# EAGLE schematic nixie_clock (EAGLE 9.5.1)
COMPANY: Gimbas; CREVISION: 0.1; DESIGNER: Rafael Silva; LICENSE: MIT; LINK: https://github.com/gimbas/nixie_clock

## Sheet 1 of 4: Nixie board
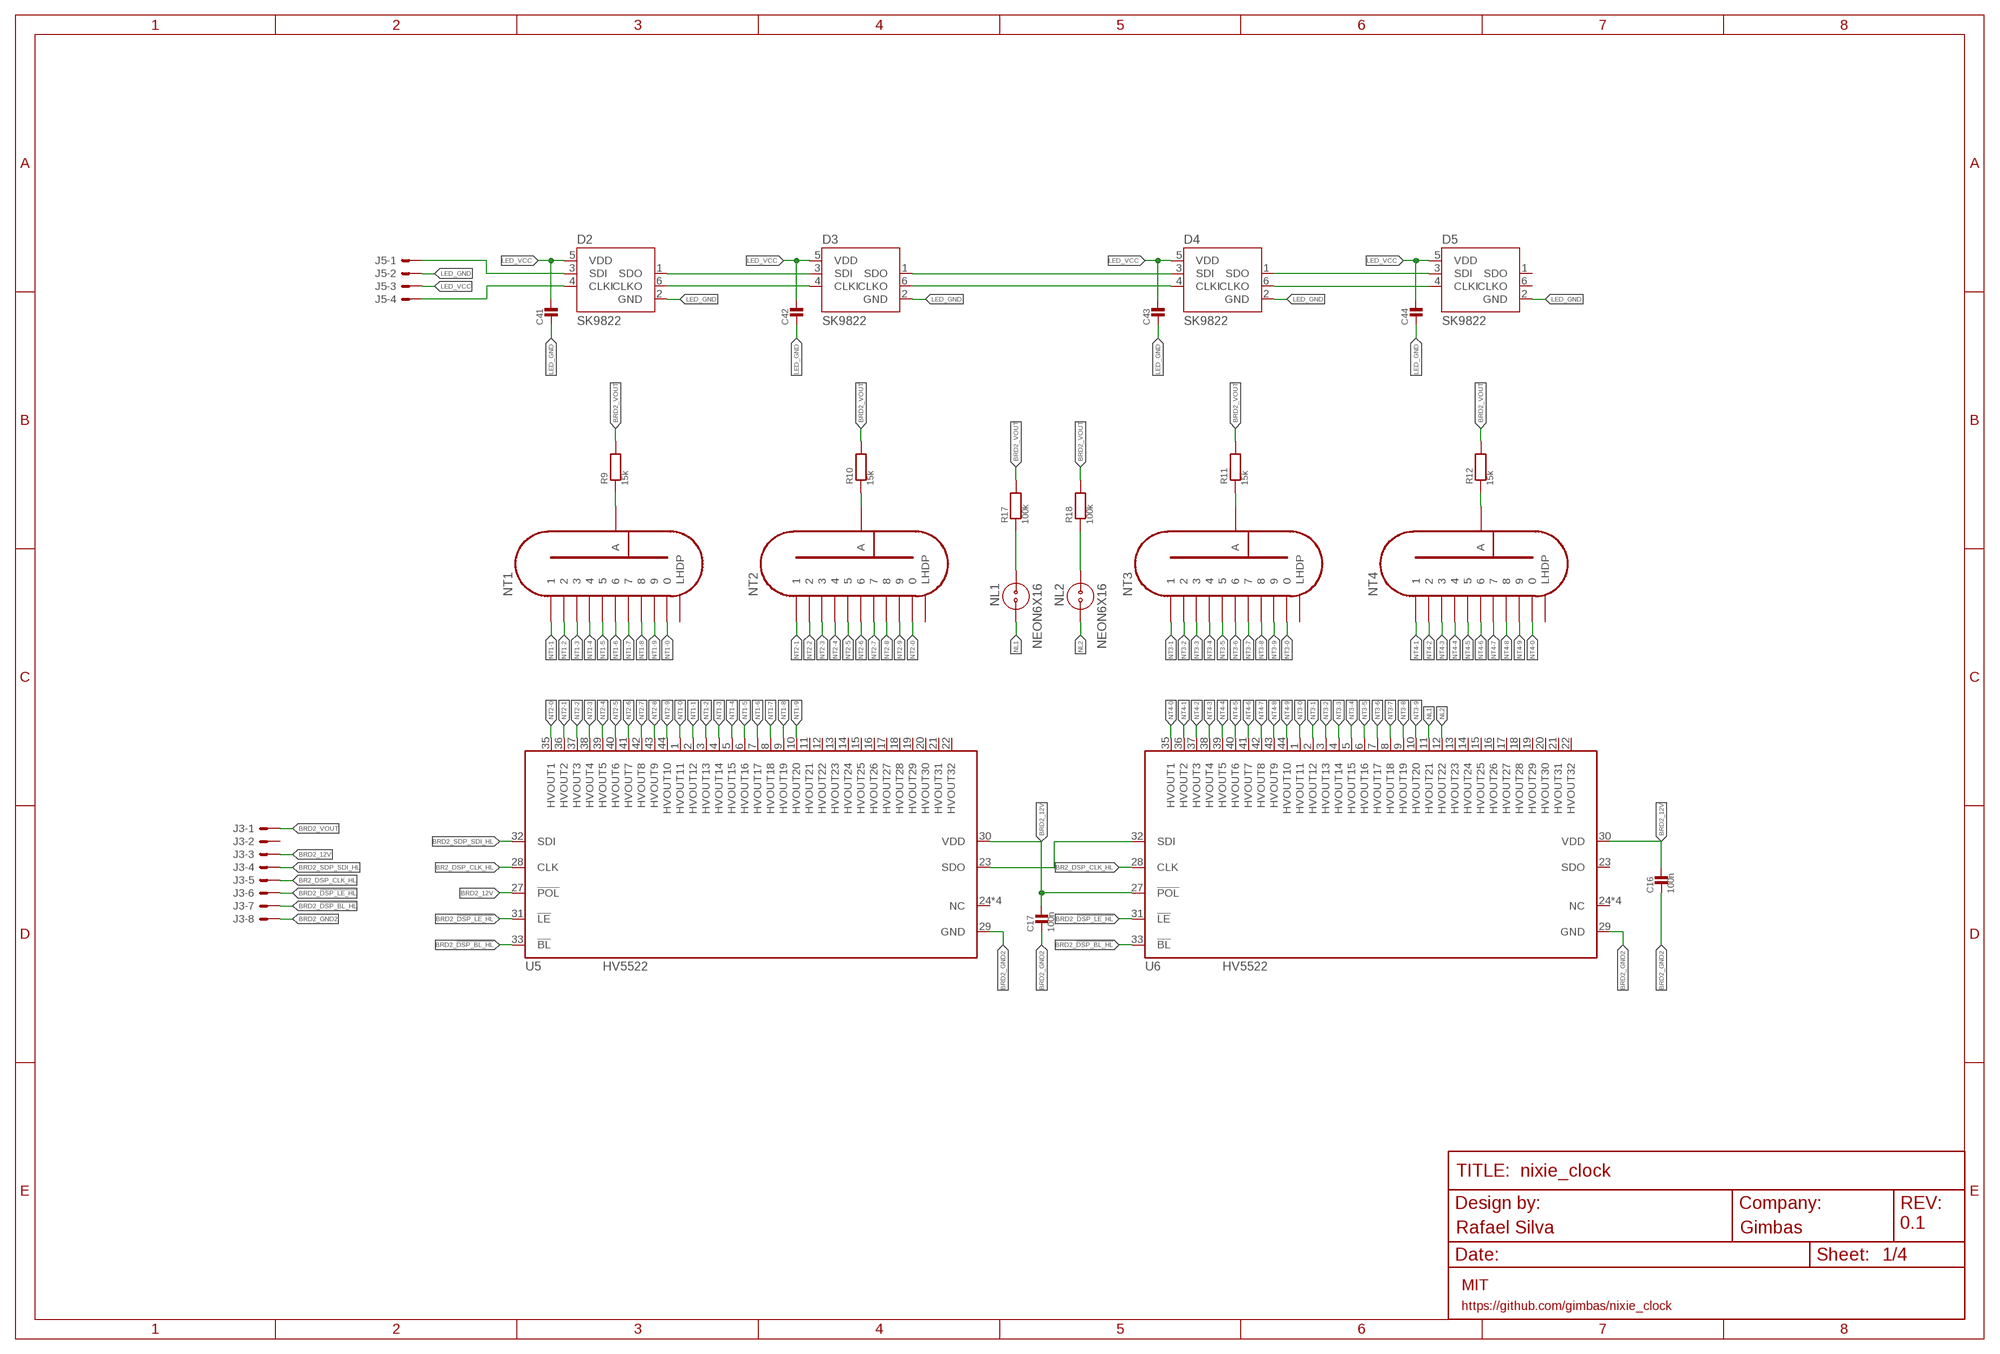
[diagram p0: schematic, sheet 1]

### Parts
C16  100n  MLCC0603  [0603_WAVE]
C17  100n  MLCC0603  [0603_WAVE]
C41  MLCC0603  [0603_WAVE]
C42  MLCC0603  [0603_WAVE]
C43  MLCC0603  [0603_WAVE]
C44  MLCC0603  [0603_WAVE]
D2  SK9822  [2020]
D3  SK9822  [2020]
D4  SK9822  [2020]
D5  SK9822  [2020]
J3  8  [1X8_2.54]
J5  4  [1X4_2.54]
NL1  NEON6X16  [NL-6X16]
NL2  NEON6X16  [NL-6X16]
NT1  IN-12B  [IN-12]
NT2  IN-12B  [IN-12]
NT3  IN-12B  [IN-12]
NT4  IN-12B  [IN-12]
R9  15k  RESISTOR_1206  [_1206]
R10  15k  RESISTOR_1206  [_1206]
R11  15k  RESISTOR_1206  [_1206]
R12  15k  RESISTOR_1206  [_1206]
R17  100k  RESISTOR_1206  [_1206]
R18  100k  RESISTOR_1206  [_1206]
U5  HV5522  [QFP64]
U6  HV5522  [QFP64]

### Nets
BR2_DSP_CLK_HL: J3.5 U5.28(CLK) U6.28(CLK)
BRD2_12V: C16.P$1 C17.P$1 J3.3 U5.27(!POL) U5.30(VDD) U6.27(!POL) U6.30(VDD)
BRD2_!DSP_BL_HL: J3.7 U5.33(!BL) U6.33(!BL)
BRD2_!DSP_LE_HL: J3.6 U5.31(!LE) U6.31(!LE)
BRD2_GND2: C16.P$2 C17.P$2 J3.8 U5.29(GND) U6.29(GND)
BRD2_SDP_SDI_HL: J3.4 U5.32(SDI)
BRD2_VOUT: J3.1 R9.2 R10.2 R11.2 R12.2 R17.2 R18.2
LED_GND: C41.P$2 C42.P$2 C43.P$2 C44.P$2 D2.2(GND) D3.2(GND) D4.2(GND) D5.2(GND) J5.2
LED_VCC: C41.P$1 C42.P$1 C43.P$1 C44.P$1 D2.5(VDD) D3.5(VDD) D4.5(VDD) D5.5(VDD) J5.3
N$1: NT1.A R9.1
N$2: NT2.A R10.1
N$14: NT3.A R11.1
N$15: NT4.A R12.1
N$19: NL1.1 R17.1
N$20: NL2.1 R18.1
N$23: U5.23(SDO) U6.32(SDI)
N$26: D2.3(SDI) J5.1
N$27: D2.4(CLKI) J5.4
N$72: D3.1(SDO) D4.3(SDI)
N$73: D3.6(CLKO) D4.4(CLKI)
N$76: D4.6(CLKO) D5.4(CLKI)
N$77: D4.1(SDO) D5.3(SDI)
N$81: D2.6(CLKO) D3.4(CLKI)
N$82: D2.1(SDO) D3.3(SDI)
NL1: NL1.2 U6.11(HVOUT21)
NL2: NL2.2 U6.12(HVOUT22)
NT1-0: NT1.0 U5.1(HVOUT11)
NT1-1: NT1.1 U5.2(HVOUT12)
NT1-2: NT1.2 U5.3(HVOUT13)
NT1-3: NT1.3 U5.4(HVOUT14)
NT1-4: NT1.4 U5.5(HVOUT15)
NT1-5: NT1.5 U5.6(HVOUT16)
NT1-6: NT1.6 U5.7(HVOUT17)
NT1-7: NT1.7 U5.8(HVOUT18)
NT1-8: NT1.8 U5.9(HVOUT19)
NT1-9: NT1.9 U5.10(HVOUT20)
NT2-0: NT2.0 U5.35(HVOUT1)
NT2-1: NT2.1 U5.36(HVOUT2)
NT2-2: NT2.2 U5.37(HVOUT3)
NT2-3: NT2.3 U5.38(HVOUT4)
NT2-4: NT2.4 U5.39(HVOUT5)
NT2-5: NT2.5 U5.40(HVOUT6)
NT2-6: NT2.6 U5.41(HVOUT7)
NT2-7: NT2.7 U5.42(HVOUT8)
NT2-8: NT2.8 U5.43(HVOUT9)
NT2-9: NT2.9 U5.44(HVOUT10)
NT3-0: NT3.0 U6.1(HVOUT11)
NT3-1: NT3.1 U6.2(HVOUT12)
NT3-2: NT3.2 U6.3(HVOUT13)
NT3-3: NT3.3 U6.4(HVOUT14)
NT3-4: NT3.4 U6.5(HVOUT15)
NT3-5: NT3.5 U6.6(HVOUT16)
NT3-6: NT3.6 U6.7(HVOUT17)
NT3-7: NT3.7 U6.8(HVOUT18)
NT3-8: NT3.8 U6.9(HVOUT19)
NT3-9: NT3.9 U6.10(HVOUT20)
NT4-0: NT4.0 U6.35(HVOUT1)
NT4-1: NT4.1 U6.36(HVOUT2)
NT4-2: NT4.2 U6.37(HVOUT3)
NT4-3: NT4.3 U6.38(HVOUT4)
NT4-4: NT4.4 U6.39(HVOUT5)
NT4-5: NT4.5 U6.40(HVOUT6)
NT4-6: NT4.6 U6.41(HVOUT7)
NT4-7: NT4.7 U6.42(HVOUT8)
NT4-8: NT4.8 U6.43(HVOUT9)
NT4-9: NT4.9 U6.44(HVOUT10)
Unconnected: D5.1(SDO) D5.6(CLKO) J3.2 NT1.LHDP NT2.LHDP NT3.LHDP NT4.LHDP U5.11(HVOUT21) U5.12(HVOUT22) U5.13(HVOUT23) U5.14(HVOUT24) U5.15(HVOUT25) U5.16(HVOUT26) U5.17(HVOUT27) U5.18(HVOUT28) U5.19(HVOUT29) U5.20(HVOUT30) U5.21(HVOUT31) U5.22(HVOUT32) U5.24(NC) U5.25(NC) U5.26(NC) U5.34(NC) U6.13(HVOUT23) U6.14(HVOUT24) U6.15(HVOUT25) U6.16(HVOUT26) U6.17(HVOUT27) U6.18(HVOUT28) U6.19(HVOUT29) U6.20(HVOUT30) U6.21(HVOUT31) U6.22(HVOUT32) U6.23(SDO) U6.24(NC) U6.25(NC) U6.26(NC) U6.34(NC)

## Sheet 2 of 4: other
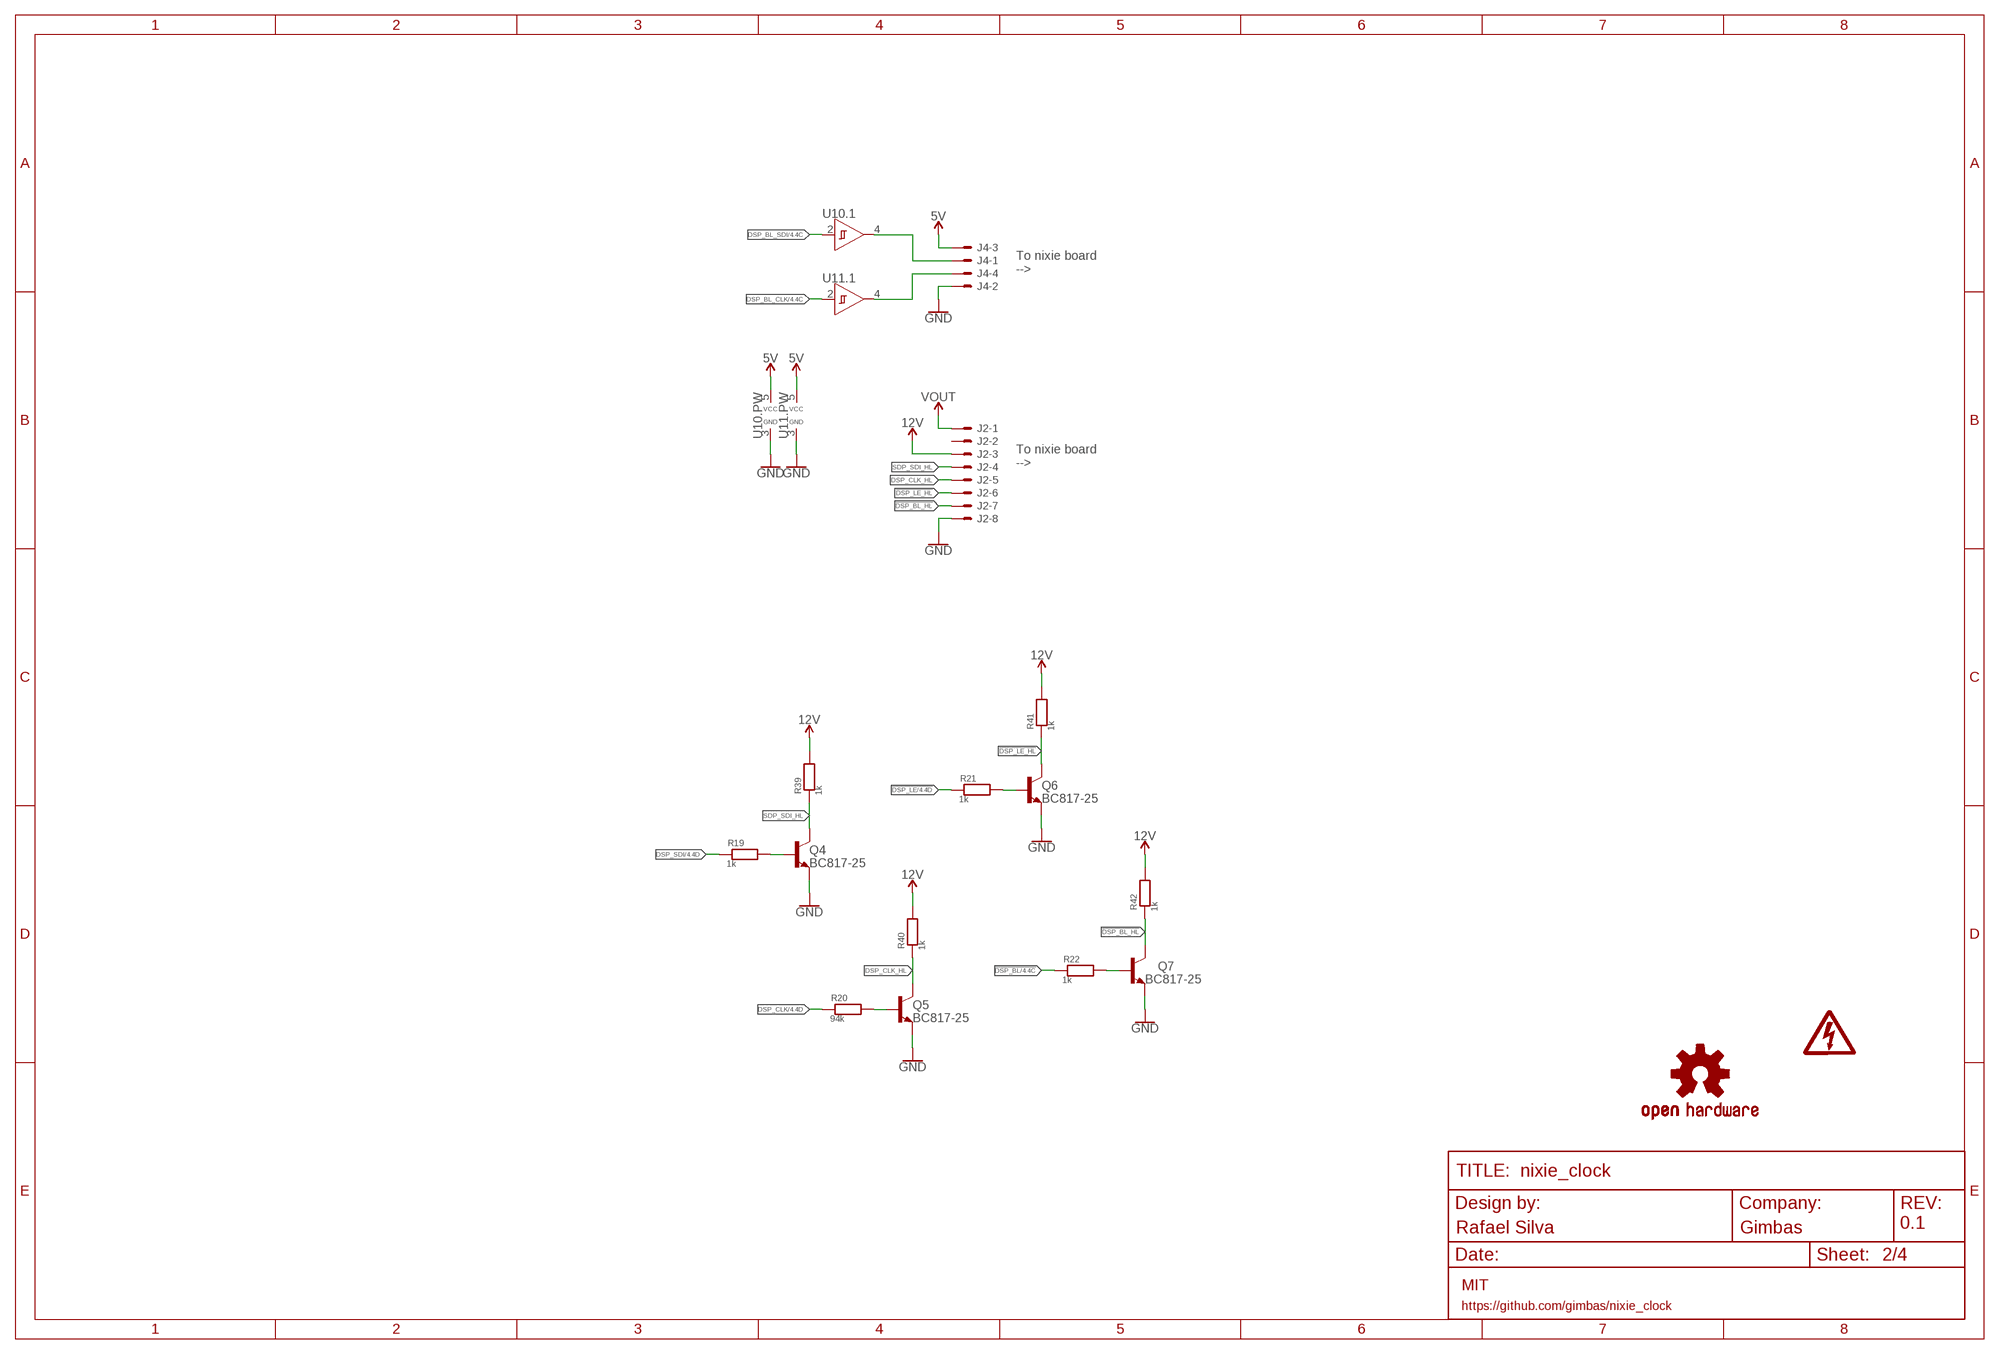
[diagram p1: schematic, sheet 2]

### Parts
J2  8  [1X8_2.54]
J4  4  [1X4_2.54]
LOGO3  OSHW-LOGOL  [OSHW-LOGO-L]
LOGO6  HV_WARNING  [HV_WARNING]
Q4  BC817-25  [SOT-23-3]
Q5  BC817-25  [SOT-23-3]
Q6  BC817-25  [SOT-23-3]
Q7  BC817-25  [SOT-23-3]
R19  1k  RESISTOR0603  [0603_WAVE]
R20  94k  RESISTOR0603  [0603_WAVE]
R21  1k  RESISTOR0603  [0603_WAVE]
R22  1k  RESISTOR0603  [0603_WAVE]
R39  1k  RESISTOR0603  [0603_WAVE]
R40  1k  RESISTOR0603  [0603_WAVE]
R41  1k  RESISTOR0603  [0603_WAVE]
R42  1k  RESISTOR0603  [0603_WAVE]
U10  74LVC1G17  [SC70-5]
U11  74LVC1G17  [SC70-5]

### Nets
5V: J4.3 U10.5(.PW:VCC) U11.5(.PW:VCC) ; also sheet 3,4
12V: J2.3 R39.P$2 R40.P$2 R41.P$2 R42.P$2 ; also sheet 3
!DSP_BL: R22.P$1 ; also sheet 4
!DSP_BL_HL: J2.7 Q7.P$3(C03) R42.P$1
!DSP_LE: R21.P$1 ; also sheet 4
!DSP_LE_HL: J2.6 Q6.P$3(C03) R41.P$1
DSP_BL_CLK: U11.2(.1:A) ; also sheet 4
DSP_BL_SDI: U10.2(.1:A) ; also sheet 4
DSP_CLK: R20.P$1 ; also sheet 4
DSP_CLK_HL: J2.5 Q5.P$3(C03) R40.P$1
DSP_SDI: R19.P$1 ; also sheet 4
GND: J2.8 J4.2 Q4.P$2(EM2) Q5.P$2(EM2) Q6.P$2(EM2) Q7.P$2(EM2) U10.3(.PW:GND) U11.3(.PW:GND) ; also sheet 3,4
N$21: Q4.P$1(BA1) R19.P$2
N$22: Q5.P$1(BA1) R20.P$2
N$24: Q7.P$1(BA1) R22.P$2
N$25: Q6.P$1(BA1) R21.P$2
N$29: J4.4 U11.4(.1:Y)
N$30: J4.1 U10.4(.1:Y)
SDP_SDI_HL: J2.4 Q4.P$3(C03) R39.P$1
VOUT: J2.1 ; also sheet 3
Unconnected: J2.2

### Notes on the sheet
- To nixie board
  -->
- To nixie board
  -->

## Sheet 3 of 4: Supplys
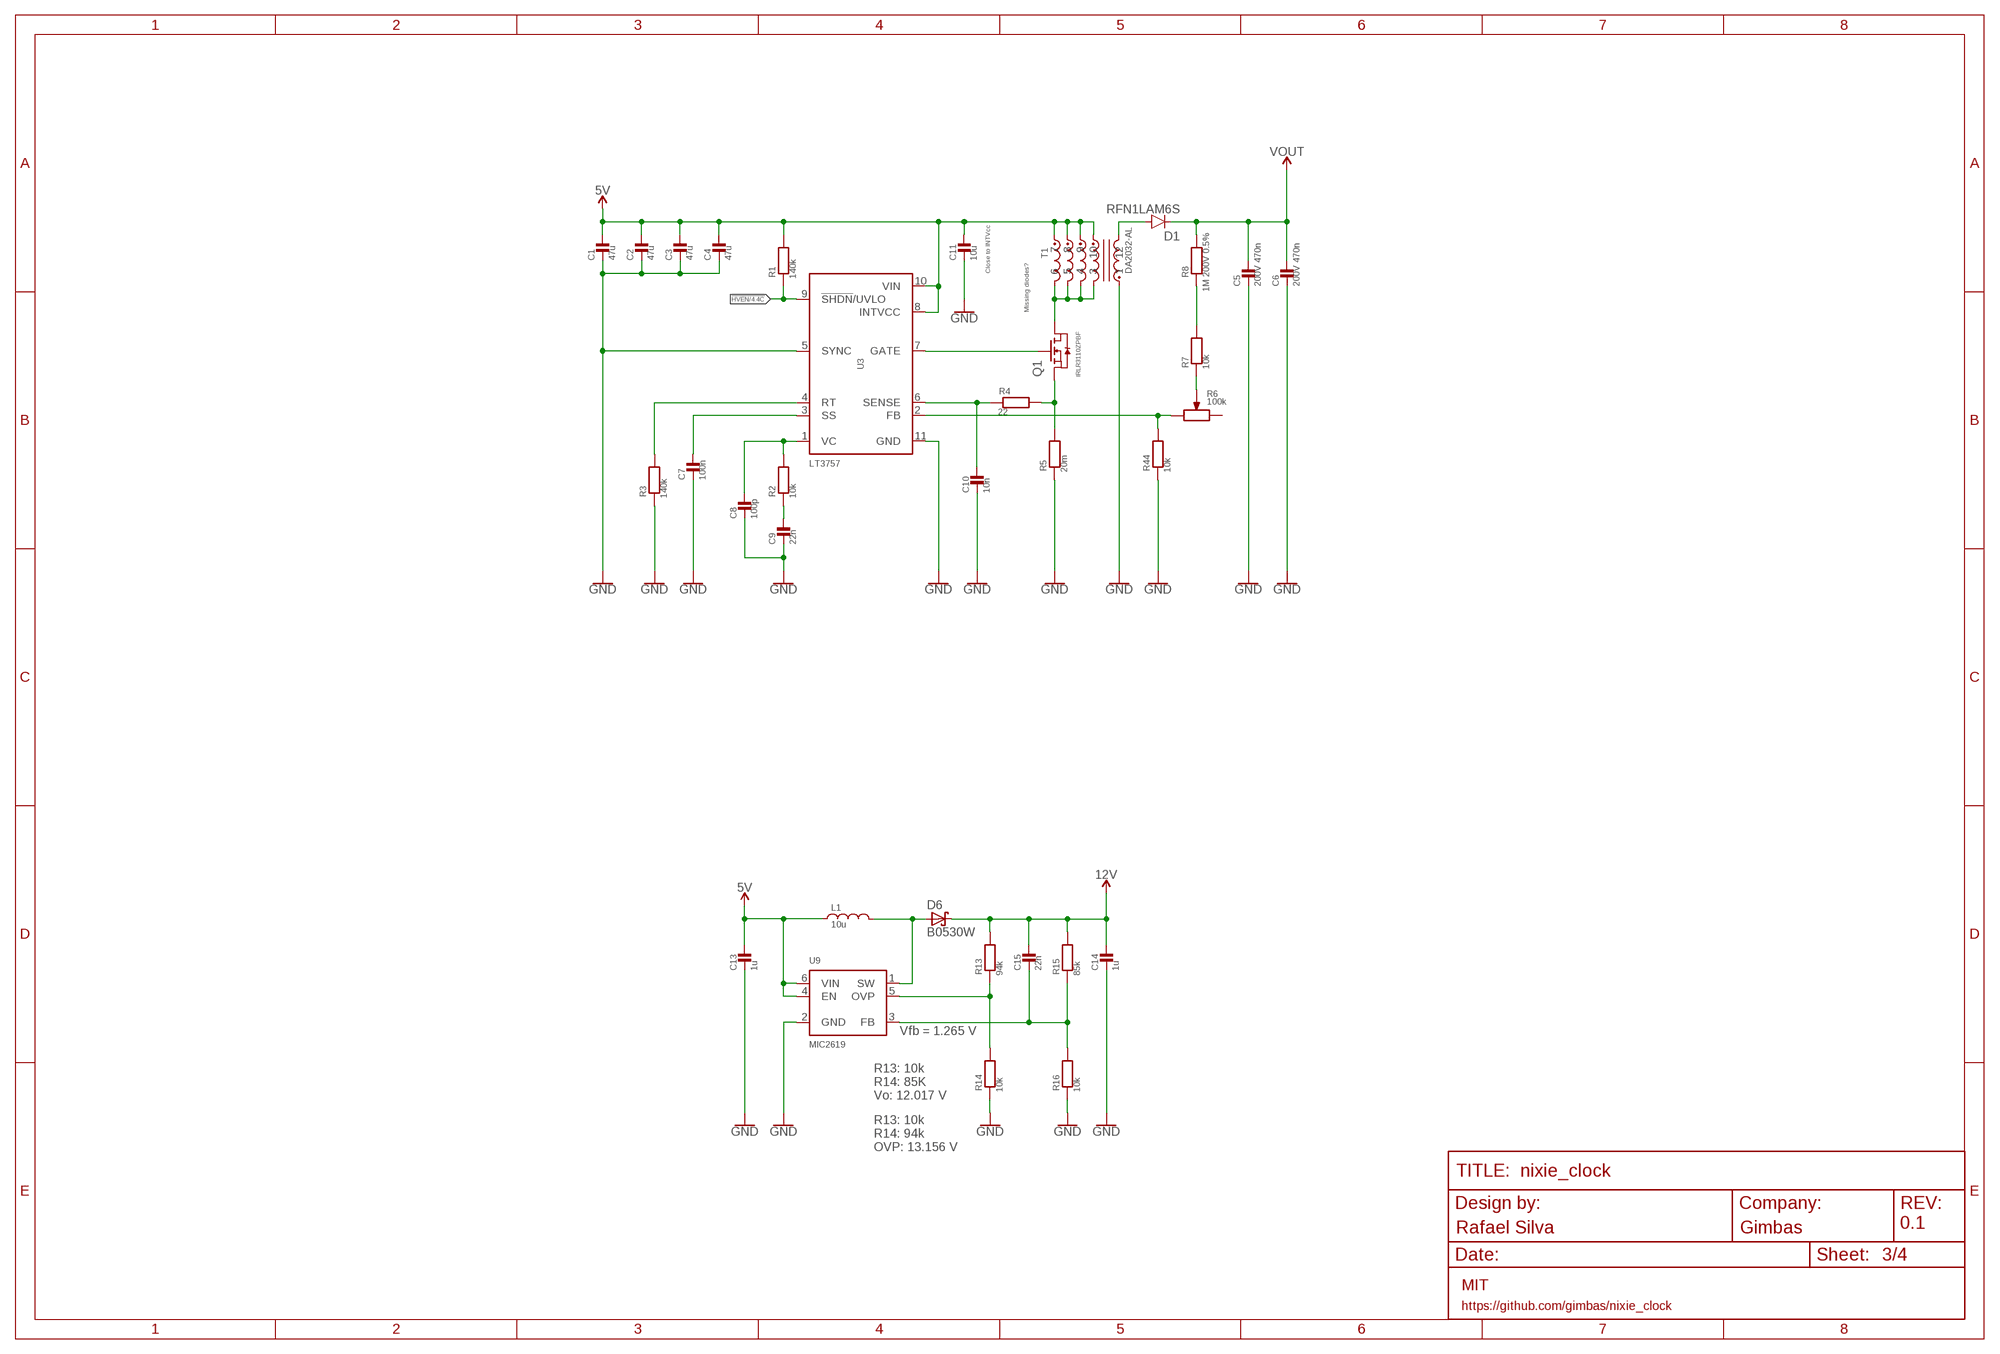
[diagram p2: schematic, sheet 3]

### Parts
C1  47u  MLCC_1210  [_1210]
C2  47u  MLCC_1210  [_1210]
C3  47u  MLCC_1210  [_1210]
C4  47u  MLCC_1210  [_1210]
C5  200V 470n  MLCC_1210  [_1210]
C6  200V 470n  MLCC_1210  [_1210]
C7  100n  MLCC0603  [0603_WAVE]
C8  100p  MLCC0603  [0603_WAVE]
C9  22n  MLCC0603  [0603_WAVE]
C10  10n  MLCC0603  [0603_WAVE]
C11  10u  MLCC0603  [0603_WAVE]
C13  1u  MLCC0603  [0603_WAVE]
C14  1u  MLCC0603  [0603_WAVE]
C15  22n  MLCC0603  [0603_WAVE]
D1  RFN1LAM6S  [SOD-128]
D6  B0530W  [SOD-123]
L1  10u  INDUCTOR_NC_1210  [_1210]
Q1  IRLR3110ZPBF  [D-PAK]
R1  140k  RESISTOR0603  [0603_WAVE]
R2  10k  RESISTOR0603  [0603_WAVE]
R3  140k  RESISTOR0603  [0603_WAVE]
R4  22  RESISTOR0603  [0603_WAVE]
R5  20m  RESISTOR_1206  [_1206]
R6  100k  RESISTOR_VARIABLE-SMD  [TC33X]
R7  10k  RESISTOR0603  [0603_WAVE]
R8  1M 200V 0.5%  RESISTOR_1206  [_1206]
R13  94k  RESISTOR0603  [0603_WAVE]
R14  10k  RESISTOR0603  [0603_WAVE]
R15  85k  RESISTOR0603  [0603_WAVE]
R16  10k  RESISTOR0603  [0603_WAVE]
R44  10k  RESISTOR0603  [0603_WAVE]
T1  DA2032-AL  [DA2032-AL]
U3  LT3757  [DFN10-2]
U9  MIC2619  [SOT-23-6N]

### Nets
5V: C1.1 C2.1 C3.1 C4.1 C11.P$1 C13.P$1 L1.1 R1.P$2 T1.7 T1.8 T1.9 T1.10 U3.8(INTVCC) U3.10(VIN) U9.4(EN) U9.6(VIN) ; also sheet 2,4
12V: C14.P$1 C15.P$1 D6.C R13.P$2 R15.P$2 ; also sheet 2
!HVEN: R1.P$1 U3.9(!SHDN!/UVLO) ; also sheet 4
GND: C1.2 C2.2 C3.2 C4.2 C5.2 C6.2 C7.P$2 C8.P$2 C9.P$2 C10.P$2 C11.P$2 C13.P$2 C14.P$2 R3.P$1 R5.1 R14.P$1 R16.P$1 R44.P$1 T1.1 U3.5(SYNC) U3.11(GND) U9.2(GND) ; also sheet 2,4
N$3: D1.AN T1.12
N$4: C10.P$1 R4.P$1 U3.6(SENSE)
N$5: Q1.L(G1) U3.7(GATE)
N$6: Q1.P(D1) T1.3 T1.4 T1.5 T1.6
N$7: Q1.R(S1) R4.P$2 R5.2
N$8: R6.2 R7.P$1
N$9: R7.P$2 R8.1
N$10: C8.P$1 R2.P$2 U3.1(VC)
N$11: C9.P$1 R2.P$1
N$12: C7.P$1 U3.3(SS)
N$13: R3.P$2 U3.4(RT)
N$16: D6.A L1.2 U9.1(SW)
N$17: R13.P$1 R14.P$2 U9.5(OVP)
N$18: C15.P$2 R15.P$1 R16.P$2 U9.3(FB)
N$32: R6.3 R44.P$2 U3.2(FB)
VOUT: C5.1 C6.1 D1.CAT R8.2 ; also sheet 2
Unconnected: R6.1

### Notes on the sheet
- Close to INTVcc
- Missing diodes?
- Vfb = 1.265 V
- R13: 10k 
  R14: 85K 
  Vo: 12.017 V
- R13: 10k 
  R14: 94k 
  OVP: 13.156 V

## Sheet 4 of 4: Controller
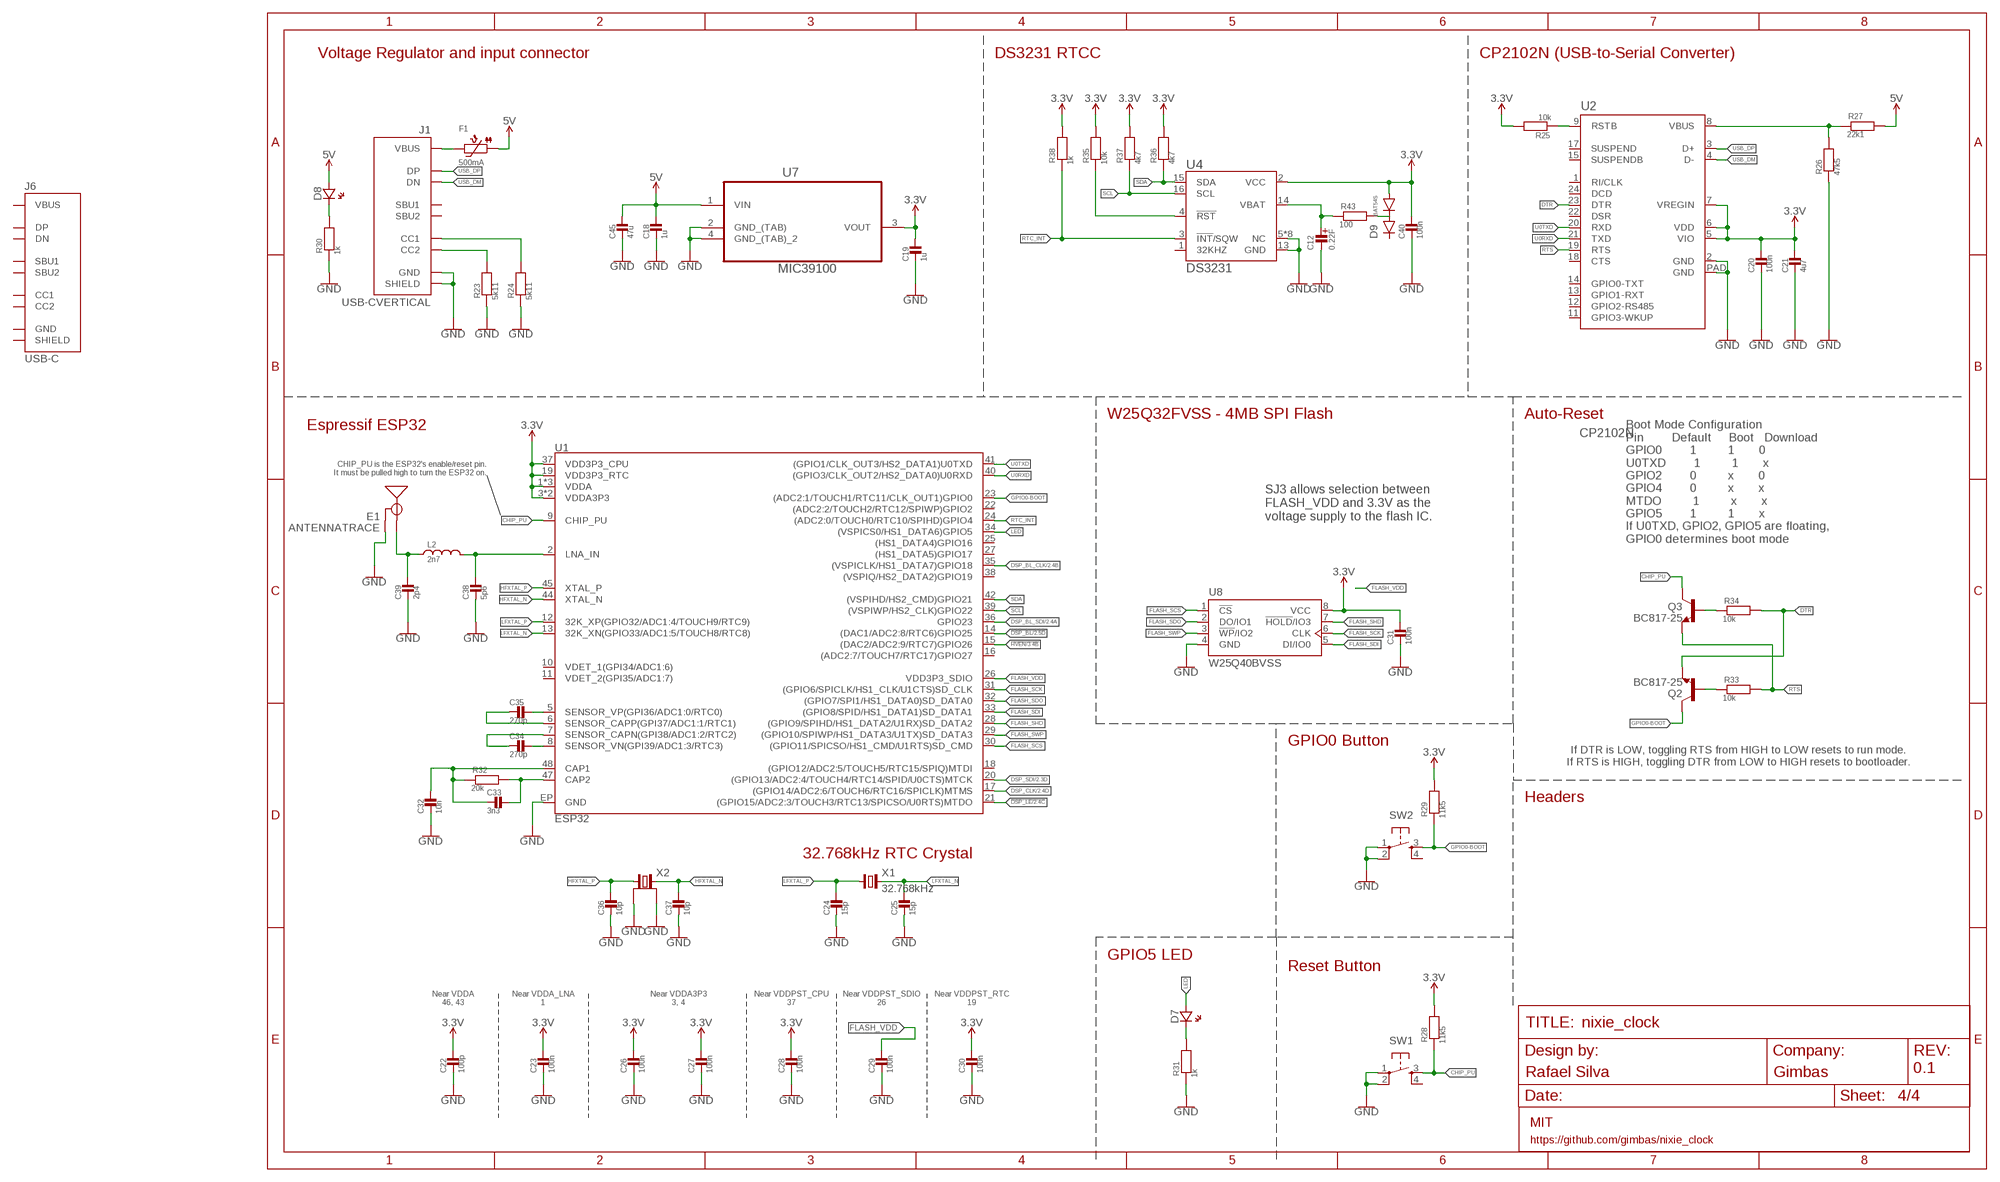
[diagram p3: schematic, sheet 4]

### Parts
C12  0.22F  DSK-614/621  [DSK-614/621]
C18  1u  MLCC0603  [0603_WAVE]
C19  1u  MLCC0603  [0603_WAVE]
C20  100n  MLCC0603  [0603_WAVE]
C21  4u7  MLCC0603  [0603_WAVE]
C22  100p  MLCC0603  [0603_WAVE]
C23  100n  MLCC0603  [0603_WAVE]
C24  15p  MLCC0603  [0603_WAVE]
C25  15p  MLCC0603  [0603_WAVE]
C26  100n  MLCC0603  [0603_WAVE]
C27  100n  MLCC0603  [0603_WAVE]
C28  100n  MLCC0603  [0603_WAVE]
C29  100n  MLCC0603  [0603_WAVE]
C30  100n  MLCC0603  [0603_WAVE]
C31  100n  MLCC0603  [0603_WAVE]
C32  10n  MLCC0603  [0603_WAVE]
C33  3n3  MLCC0603  [0603_WAVE]
C34  270p  MLCC0603  [0603_WAVE]
C35  270p  MLCC0603  [0603_WAVE]
C36  10p  MLCC0603  [0603_WAVE]
C37  10p  MLCC0603  [0603_WAVE]
C38  5p6  MLCC0603  [0603_WAVE]
C39  2p4  MLCC0603  [0603_WAVE]
C40  100n  MLCC0603  [0603_WAVE]
C45  47u  MLCC_1210  [_1210]
D7  LED0603  [CHIPLED_0603]
D8  LED0603  [CHIPLED_0603]
D9  BAT54S  [SOT-23-3]
E1  ANTENNATRACE  [TRACE_ANTENNA_2.4GHZ_25.7MM]
F1  500mA  PTC0805  [0805]
J1  USB-CVERTICAL  [USB-C-V]
J6  USB-C  [USB-C]
L2  2n7  INDUCTOR_NC_0603  [_0603]
Q2  BC817-25  [SOT-23-3]
Q3  BC817-25  [SOT-23-3]
R23  5k11  RESISTOR0603  [0603_WAVE]
R24  5k11  RESISTOR0603  [0603_WAVE]
R25  10k  RESISTOR0603  [0603_WAVE]
R26  47k5  RESISTOR0603  [0603_WAVE]
R27  22k1  RESISTOR0603  [0603_WAVE]
R28  11k5  RESISTOR0603  [0603_WAVE]
R29  11k5  RESISTOR0603  [0603_WAVE]
R30  1k  RESISTOR0603  [0603_WAVE]
R31  1k  RESISTOR0603  [0603_WAVE]
R32  20k  RESISTOR0603  [0603_WAVE]
R33  10k  RESISTOR0603  [0603_WAVE]
R34  10k  RESISTOR0603  [0603_WAVE]
R35  10k  RESISTOR0603  [0603_WAVE]
R36  4k7  RESISTOR0603  [0603_WAVE]
R37  4k7  RESISTOR0603  [0603_WAVE]
R38  1k  RESISTOR0603  [0603_WAVE]
R43  100  RESISTOR0603  [0603_WAVE]
SW1  PUSH_BUTTON3X4X2  [3X4X2]
SW2  PUSH_BUTTON3X4X2  [3X4X2]
U1  ESP32  [QFN48-0.4MM]
U2  CP2102N  [QFN24]
U4  DS3231  [SOIC-16]
U7  MIC39100  [SOT230P700X180-4N]
U8  W25Q40BVSS  [SO08-SS]
X1  32.768kHz  CRYSTAL2-SMD-3215  [2-SMD-3215]
X2  26MHz  CRYSTAL_4P  [4-SMD-3225]

### Nets
3.3V: C19.P$1 C20.P$1 C21.P$1 C22.P$1 C23.P$1 C26.P$1 C27.P$1 C28.P$1 C30.P$1 C31.P$1 C40.P$1 D9.P$1 R25.P$2 R28.P$2 R29.P$2 R35.P$2 R36.P$2 R37.P$2 R38.P$2 U1.1(VDDA) U1.3(VDDA3P3) U1.4(VDDA3P3) U1.19(VDD3P3_RTC) U1.37(VDD3P3_CPU) U1.43(VDDA) U1.46(VDDA) U2.5(VIO) U2.6(VDD) U2.7(VREGIN) U4.2(VCC) U7.3(VOUT) U8.8(VCC)
5V: C18.P$1 C45.1 D8.A(AN) F1.1 R27.P$2 U7.1(VIN) ; also sheet 2,3
!DSP_BL: U1.14((DAC1/ADC2:8/RTC6)GPIO25) ; also sheet 2
!DSP_LE: U1.21((GPIO15/ADC2:3/TOUCH3/RTC13/SPICSO/U0RTS)MTDO) ; also sheet 2
!HVEN: U1.15((DAC2/ADC2:9/RTC7)GPIO26) ; also sheet 3
CHIP_PU: Q3.P$3(C03) R28.P$1 SW1.3 U1.9(CHIP_PU)
DSP_BL_CLK: U1.35((VSPICLK/HS1_DATA7)GPIO18) ; also sheet 2
DSP_BL_SDI: U1.36(GPIO23) ; also sheet 2
DSP_CLK: U1.17((GPIO14/ADC2:6/TOUCH6/RTC16/SPICLK)MTMS) ; also sheet 2
DSP_SDI: U1.20((GPIO13/ADC2:4/TOUCH4/RTC14/SPID/U0CTS)MTCK) ; also sheet 2
DTR: Q2.P$2(EM2) R34.P$2 U2.23(DTR)
FLASH_SCK: U1.31((GPIO6/SPICLK/HS1_CLK/U1CTS)SD_CLK) U8.6(CLK)
FLASH_SCS: U1.30((GPIO11/SPICSO/HS1_CMD/U1RTS)SD_CMD) U8.1(!CS!)
FLASH_SDI: U1.33((GPIO8/SPID/HS1_DATA1)SD_DATA1) U8.5(DI/IO0)
FLASH_SDO: U1.32((GPIO7/SPI1/HS1_DATA0)SD_DATA0) U8.2(DO/IO1)
FLASH_SHD: U1.28((GPIO9/SPIHD/HS1_DATA2/U1RX)SD_DATA2) U8.7(!HOLD!/IO3)
FLASH_SWP: U1.29((GPIO10/SPIWP/HS1_DATA3/U1TX)SD_DATA3) U8.3(!WP!/IO2)
FLASH_VDD: C29.P$1 U1.26(VDD3P3_SDIO)
GND: C12.2(CA) C18.P$2 C19.P$2 C20.P$2 C21.P$2 C22.P$2 C23.P$2 C24.P$2 C25.P$2 C26.P$2 C27.P$2 C28.P$2 C29.P$2 C30.P$2 C31.P$2 C32.P$2 C36.P$2 C37.P$2 C38.P$2 C39.P$2 C40.P$2 C45.2 E1.GND E1.GND2(GND) J1.A1(GND) J1.B12(GND) J1.SHIELD0(SHIELD) J1.SHIELD1(SHIELD) J1.SHIELD2(SHIELD) J1.SHIELD3(SHIELD) R23.P$1 R24.P$1 R26.P$1 R30.P$1 R31.P$1 SW1.1 SW1.2 SW2.1 SW2.2 U1.EP(GND) U2.2(GND) U2.PAD(GND) U4.5(NC) U4.6(NC) U4.7(NC) U4.8(NC) U4.9(NC) U4.10(NC) U4.11(NC) U4.12(NC) U4.13(GND) U7.2(GND_(TAB)) U7.4(GND_(TAB)_2) U8.4(GND) X2.1(GND) X2.3(GND) ; also sheet 2,3
GPIO0-BOOT: Q2.P$3(C03) R29.P$1 SW2.3 U1.23((ADC2:1/TOUCH1/RTC11/CLK_OUT1)GPIO0)
HFXTAL_N: C37.P$1 U1.44(XTAL_N) X2.4
HFXTAL_P: C36.P$1 U1.45(XTAL_P) X2.2
LED: D7.A(AN) U1.34((VSPICS0/HS1_DATA6)GPIO5)
LFXTAL_N: C25.P$1 U1.13(32K_XN(GPIO33/ADC1:5/TOUCH8/RTC8)) X1.2
LFXTAL_P: C24.P$1 U1.12(32K_XP(GPIO32/ADC1:4/TOUCH9/RTC9)) X1.1
N$28: C39.P$1 E1.ANT(SIGNAL) L2.1
N$31: D9.P$3 R43.P$2
N$74: F1.2 J1.A4(VBUS) J1.A9(VBUS) J1.B4(VBUS) J1.B9(VBUS)
N$75: J1.B5(CC2) R23.P$2
N$78: J1.A5(CC1) R24.P$2
N$79: R25.P$1 U2.9(RSTB)
N$80: D8.C(CA) R30.P$2
N$83: R26.P$2 R27.P$1 U2.8(VBUS)
N$84: D7.C(CA) R31.P$2
N$85: C33.P$1 R32.P$2 U1.47(CAP2)
N$86: C34.P$1 U1.8(SENSOR_VN(GPI39/ADC1:3/RTC3))
N$87: C32.P$1 C33.P$2 R32.P$1 U1.48(CAP1)
N$88: C35.P$1 U1.5(SENSOR_VP(GPI36/ADC1:0/RTC0))
N$89: C34.P$2 U1.7(SENSOR_CAPN(GPI38/ADC1:2/RTC2))
N$90: C35.P$2 U1.6(SENSOR_CAPP(GPI37/ADC1:1/RTC1))
N$91: C38.P$1 L2.2 U1.2(LNA_IN)
N$92: Q2.P$1(BA1) R33.P$1
N$93: Q3.P$1(BA1) R34.P$1
N$95: C12.1(AN) R43.P$1 U4.14(VBAT)
N$96: R35.P$1 U4.4(!RST)
RTC_INT: R38.P$1 U1.24((ADC2:0/TOUCH0/RTC10/SPIHD)GPIO4) U4.3(!INT!/SQW)
RTS: Q3.P$2(EM2) R33.P$2 U2.19(RTS)
SCL: R37.P$1 U1.39((VSPIWP/HS2_CLK)GPIO22) U4.16(SCL)
SDA: R36.P$1 U1.42((VSPIHD/HS2_CMD)GPIO21) U4.15(SDA)
U0RXD: U1.40((GPIO3/CLK_OUT2/HS2_DATA0)U0RXD) U2.21(TXD)
U0TXD: U1.41((GPIO1/CLK_OUT3/HS2_DATA1)U0TXD) U2.20(RXD)
USB_DM: J1.A7(DN) J1.B7(DN) U2.4(D-)
USB_DP: J1.A6(DP) J1.B6(DP) U2.3(D+)
Unconnected: D9.P$2 J1.A8(SBU1) J1.B8(SBU2) J6.A1/B12(GND) J6.A4/B9(VBUS) J6.A5(CC1) J6.A6(DP) J6.A7(DN) J6.A8(SBU1) J6.B1/A12(GND) J6.B4/A9(VBUS) J6.B5(CC2) J6.B6(DP) J6.B7(DN) J6.B8(SBU2) J6.SHIELD0(SHIELD) J6.SHIELD1(SHIELD) J6.SHIELD2(SHIELD) J6.SHIELD3(SHIELD) SW1.4 SW2.4 U1.10(VDET_1(GPI34/ADC1:6)) U1.11(VDET_2(GPI35/ADC1:7)) U1.16((ADC2:7/TOUCH7/RTC17)GPIO27) U1.18((GPIO12/ADC2:5/TOUCH5/RTC15/SPIQ)MTDI) U1.22((ADC2:2/TOUCH2/RTC12/SPIWP)GPIO2) U1.25((HS1_DATA4)GPIO16) U1.27((HS1_DATA5)GPIO17) U1.38((VSPIQ/HS2_DATA2)GPIO19) U2.1(RI/CLK) U2.11(GPIO3-WKUP) U2.12(GPIO2-RS485) U2.13(GPIO1-RXT) U2.14(GPIO0-TXT) U2.15(SUSPENDB) U2.17(SUSPEND) U2.18(CTS) U2.22(DSR) U2.24(DCD) U4.1(32KHZ)

### Notes on the sheet
- Voltage Regulator and input connector | DS3231 RTCC | CP2102N (USB-to-Serial Converter)
- W25Q32FVSS - 4MB SPI Flash | Auto-Reset
- Espressif ESP32
- CHIP_PU is the ESP32's enable/reset pin.
  It must be pulled high to turn the ESP32 on.
- SJ3 allows selection between 
  FLASH_VDD and 3.3V as the
  voltage supply to the flash IC.
- Boot Mode Configuration
  Pin        Default     Boot   Download
  GPIO0        1         1       0
  U0TXD        1         1       x
  GPIO2        0         x       0
  GPIO4        0         x       x
  MTDO         1         x       x
  GPIO5        1         1       x
  If U0TXD, GPIO2, GPIO5 are floating, 
  GPIO0 determines boot mode
- GPIO0 Button
- If DTR is LOW, toggling RTS from HIGH to LOW resets to run mode.
  If RTS is HIGH, toggling DTR from LOW to HIGH resets to bootloader.
- Headers
- 32.768kHz RTC Crystal
- GPIO5 LED
- Reset Button
- Near VDDA
  46, 43
- Near VDDA_LNA
  1
- Near VDDA3P3
  3, 4
- Near VDDPST_CPU
  37
- Near VDDPST_SDIO
  26
- Near VDDPST_RTC
  19

## Library data of the parts
C1-C11 C13-C45 = Passive Components > Capacitors > Multilayer Ceramic Capacitors MLCC:MLCC: KEMET’s X7R dielectric features a 125°C maximum operating temperature and is considered temperature stable. The Electronics Components, Assemblies and Materials Association (EIA) characterizes X7R dielectric as a Class II material. Components of this classification are fixed, ceramic dielectric capacitors suited for bypass and decoupling applications or for frequency discriminating circuits where Q and stability of capacitance characteristics are not critical. X7R exhibits a predictable change in capacitance with respect to time and voltage, boasting a minimal change in capacitance with reference to ambient temperature. Capacitance change is limited to ±15% from −55°C to +125°C.
C12 = Passive Components > Capacitors > Supercapacitors \ Ultracapacitors:DSK-614/621
D1 = Semiconductors > Discrete Semiconductors > Diodes & Rectifiers > General Purpose, Power, Switching:RFN1LAM6S
D2-D5 = Opto-electronics > LED Emitters:SK9822
D6 = Semiconductors > Discrete Semiconductors > Diodes & Rectifiers > Schottky Diodes & Rectifiers:B0530W
D7 D8 = Opto-electronics > LED Emitters:LED: LED 0603 - 0603 Surface Mount Package 2mA: Green LED - Low Power (3.9mcd, 2ma, 1.7Vf) - Digikey: 475-2709-2-ND Orange LED - Low Power (9.8mcd, 2ma, 1.8Vf) - Digikey: 475-1194-2-ND Red LED - Low Power (5mcd, 2ma, 1.8Vf) - Digikey: 475-1195-2-ND Yellow LED - Low Power (7mcd, 2ma, 1.8Vf) - Digikey: 475-1196-2-ND 5mA: Blue LED - Low Power (17mcd, 5ma, 2.9Vf) - Digikey: LNJ937W8CRACT-ND 0805 - 0805 Surface Mount Package 2mA: Red LED (8.8mcd, 2mA, 1.8Vf, Clear) - Low Power [Digikey: 475-2510-1-ND] Green LED (5mcd, 2mA, 1.8Vf, Clear) - Low Power [Digikey: 475-2730-1-ND] Yellow LED (11.3mcd, 2mA, 1.8Vf, Clear) - Low Power [Digikey: 475-2555-1-ND] 20mA: Red LED (104mcd, 20mA, Diffused) - LS R976 [Digikey: 475-1278-6-ND] Red LED (12mcd, 20mA, 2.0Vf, Clear) - APT2012EC [Digikey: 754-1128-1-ND] Green LED (15mcd, 20mA, 2.2Vf, Clear) - APT2012GC [Digikey: 754-1131-1-ND] Orange LED (160mcd, 20mA, 2.1Vf, Clear) - APT2012SECK [Digikey: 754-1130-1-ND] 1206 - 1206 Surface Mount Package Green LED (26mcd, 20mA, Diffused) - LG N971 [Digikey: 475-1407-6-ND] Red LED (15mcd, 20mA, Diffused) - LH N974 [Digikey: 475-1416-6-ND] Cree - Cree High-Power Surface Mount LEDs XPEBWT-L1-0000-00D50 - White 111lm 350mA 2.9Vf 6200K 110° XTEAWT-00-0000-00000LEE3 - White 114lm 350mA 2.85Vf 5000K 115° Everlight - Everlight 45-21 Series Surface Mount LEDs 45-21/QK2C-B2832AC2CB2/2T - Warm White 2000mcd 20mA 3.25Vf 3050K 120° 45-21/LK2C-B38452C4CB2/2T - Nuetral White 2000mcd 20mA 3.25Vf 4150K 120° 45-21/LK2C-B50634C6CB2/2T - Cold White 2200mcd 20mA 3.25Vf 5650K 120° PLCC2 Reverse Mount LS T77K-J1L2-1-0-2-R18-Z - Red 11.25mcd 2mA 1.8Vf 630nm 120° LO T77K-L1M2-24-Z - Orange 19.6mcd 2mA 1.8Vf 606nm 120° LY T77K-K2M1-26-Z - Yellow 15.7mcd 2mA 1.8Vf 587nm 120°
D9 = Semiconductors > Discrete Semiconductors > Diodes & Rectifiers > Schottky Diodes & Rectifiers:BAT54S
E1 = Passive Components > Antennas:ANTENNA: Chip antenna Chip antenna with ground or secondary connection. Common with larger metal RF connectors.
F1 = Circuit Protection > Resettable Fuses - PPTC:PTC
J1 J6 = Connectors > USB:USB-C
J2 J3 = Connectors > Header:8
J4 J5 = Connectors > Header:4
L1 L2 = Passive Components > Inductors, Chokes & Coils:INDUCTOR_NC
LOGO3 = Utility > Silkscreen:OSHW-LOGO: Open-Source Hardware (OSHW) Logo This logo indicates the piece of hardware it is found on incorporates a OSHW license and/or adheres to the definition of open source hardware found here: http://freedomdefined.org/OSHW
LOGO6 = Silkscreen:HV_WARNING
NL1 NL2 = vacuum_tubes:NEON
NT1-NT4 = vacuum_tubes:IN-12B: IN-12B: medium numeric topview nixie tube
Q1 = Semiconductors > Discrete Semiconductors > Transistors > MOSFETs:IRLR3110ZPBF
Q2-Q7 = Semiconductors > Discrete Semiconductors > Transistors > Bipolar Transistors - BJT:BC817-25
R1-R5 R7-R44 = Passive Components > Resistors > Chip Resistors:RESISTOR: Resistors For new designs, use the packages preceded by an '_' character since they are more reliable: The following footprints should be used on most boards: _0402 - Standard footprint for regular board layouts _0603 - Standard footprint for regular board layouts _0805 - Standard footprint for regular board layouts _1206 - Standard footprint for regular board layouts For extremely tight-pitch boards where space is at a premium, the following 'micro-pitch' footprints can be used (smaller pads, no silkscreen outline, etc.): _0402MP - Micro-pitch footprint for very dense/compact boards _0603MP - Micro-pitch footprint for very dense/compact boards _0805MP - Micro-pitch footprint for very dense/compact boards _1206MP - Micro-pitch footprint for very dense/compact boards
R6 = Passive Components > Potentiometers, Trimmers & Rheostats:RESISTOR_VARIABLE
SW1 SW2 = Eletromechanical > Switches > Tactile Switches:PUSH_BUTTON
T1 = Passive Components > Inductors, Chokes & Coils:DA2032-AL
U1 = Semiconductors > Embedded Processors & Controllers > Microcontrollers - MCU:ESP32: Espressif ESP32 WiFi-compatible SoC microcontroller. Bluetooth Low energy support (BLE, BT4.0, Bluetooth Smart) 28 GPIO pins Dual-core Tensilica LX6 microprocessor Hardware accelerated encryption (AES, SHA2, ECC, RSA-4096) 4MB Flash memory 520kB internal SRAM Datasheet <https://cdn.sparkfun.com/datasheets/IoT/esp32_datasheet_en.pdf> SparkFun Products: SparkFun ESP32 Thing <https://www.sparkfun.com/products/13907>; PROD_ID: IC-13338
U2 = Semiconductors > Integrated Circuits - ICs > Interface ICs > USB Interface IC:CP2102N
U3 = Power > Switching Controllers:LT3757
U4 = Semiconductors > Integrated Circuits - ICs > Clock & Timer ICs > Real Time Clock:DS3231
U5 U6 = Power > Power Switch:HV5522
U7 = Power > LDO Voltage Regulators:MIC39100: IC, LDO VOLT REG, 3.3V, 0.3A,; MPN: MCP1824ST-3302E/DB; OC_FARNELL: 1578379; OC_NEWARK: 05N1293; PACKAGE: SOT-223-3; SUPPLIER: Microchip
U8 = Semiconductors > Integrated Circuits - ICs > Memory ICs > Flash:W25Q40BV: EEPROM 4 Mbit SPI Serial Flash with Dual and Quad SPI
U9 = Power > Switching Controllers:MIC2619
U10 U11 = Semiconductors > Integrated Circuits - ICs > Logic ICs > Logic Gates:74LVC1G17
X1 = Passive Components > Frequency Control & Timing Devices > Crystals:CRYSTAL
X2 = Passive Components > Frequency Control & Timing Devices > Crystals:CRYSTAL_4P